# Altium schematic sheet Sensors.SchDoc
size A4; SheetNumber: 2; SheetTotal: 10
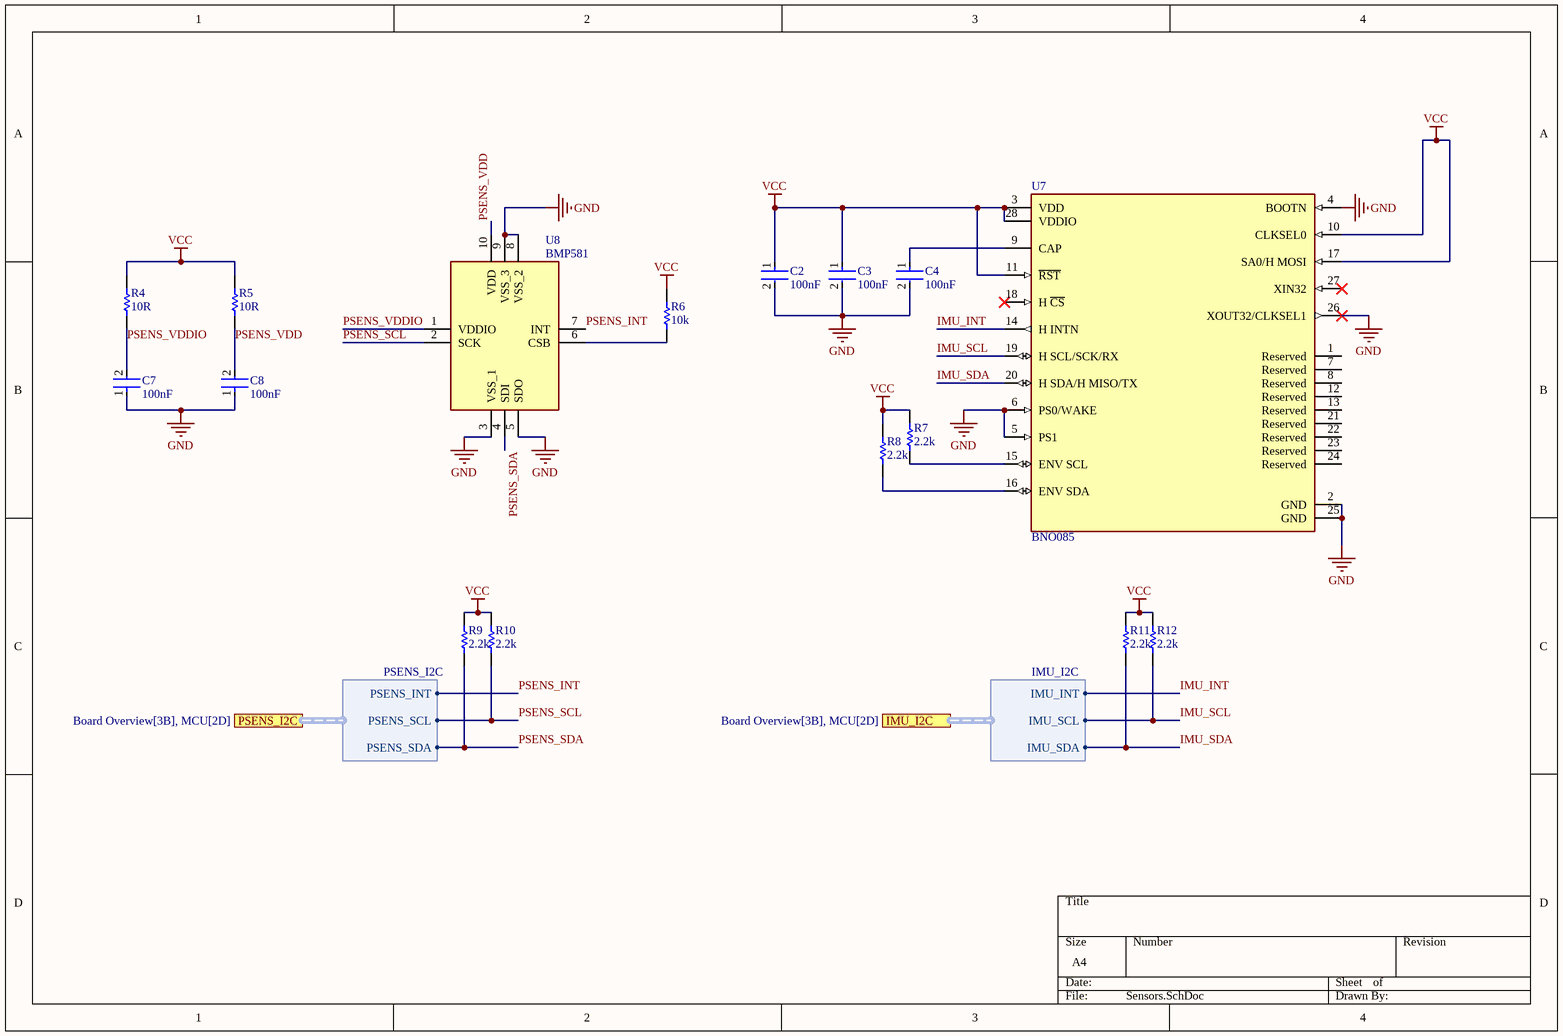
[diagram p0: Sensors.SchDoc]

## Parts
C2  value 100nF  [FP-0603-L_1_6_0_15-W_0_81-IPC_C]  (hidden comment: Generic-Capacitor)
C3  value 100nF  [FP-0603-L_1_6_0_15-W_0_81-IPC_C]  (hidden comment: Generic-Capacitor)
C4  value 100nF  [FP-0603-L_1_6_0_15-W_0_81-IPC_C]  (hidden comment: Generic-Capacitor)
C7  value 100nF  [FP-0603-L_1_6_0_15-W_0_81-IPC_C]  (hidden comment: Generic-Capacitor)
C8  value 100nF  [FP-0603-L_1_6_0_15-W_0_81-IPC_C]  (hidden comment: Generic-Capacitor)
R4  value 10R  [RESC1609X50X30ML8T20]  (hidden comment: Generic-Resistor)
R5  value 10R  [RESC1609X50X30ML8T20]  (hidden comment: Generic-Resistor)
R6  value 10k  [RESC1609X50X30ML8T20]  (hidden comment: Generic-Resistor)
R7  value 2.2k  [RESC1609X50X30ML8T20]  (hidden comment: Generic-Resistor)
R8  value 2.2k  [RESC1609X50X30ML8T20]  (hidden comment: Generic-Resistor)
R9  value 2.2k  [RESC1609X50X30ML8T20]  (hidden comment: Generic-Resistor)
R10  value 2.2k  [RESC1609X50X30ML8T20]  (hidden comment: Generic-Resistor)
R11  value 2.2k  [RESC1609X50X30ML8T20]  (hidden comment: Generic-Resistor)
R12  value 2.2k  [RESC1609X50X30ML8T20]  (hidden comment: Generic-Resistor)
U7  BNO085  [FP-BNO085-MFG]
U8  BMP581  [BMP581]

## Ports
IMU_I2C (harness IMU_I2C, see Board Overview[3B], MCU[2D]), PSENS_I2C (harness PSENS_I2C, see Board Overview[3B], MCU[2D])

## Harnesses
IMU_I2C: IMU_INT, IMU_SCL, IMU_SDA
PSENS_I2C: PSENS_INT, PSENS_SCL, PSENS_SDA

## Nets
GND: C2.2 C3.2 C4.2 C7.1 C8.1 U7.2(GND) U7.4(BOOTN) U7.5(PS1) U7.6(PS0/WAKE) U7.25(GND) U7.26(XOUT32/CLKSEL1) U8.3(VSS_1) U8.5(SDO) U8.8(VSS_2) U8.9(VSS_3)
VCC: C2.1 C3.1 R4.2 R5.2 R6.2 R7.1 R8.1 R9.1 R10.1 R11.1 R12.1 U7.3(VDD) U7.10(CLKSEL0) U7.11(~{RST}) U7.17(SA0/H_MOSI) U7.28(VDDIO)
IMU_INT: U7.14(H_INTN) ; port IMU_I2C.IMU_INT
IMU_SCL: R12.2 U7.19(H_SCL/SCK/RX) ; port IMU_I2C.IMU_SCL
IMU_SDA: R11.2 U7.20(H_SDA/H_MISO/TX) ; port IMU_I2C.IMU_SDA
PSENS_INT: U8.7(INT) ; port PSENS_I2C.PSENS_INT
PSENS_SCL: R10.2 U8.2(SCK) ; port PSENS_I2C.PSENS_SCL
PSENS_SDA: R9.2 U8.4(SDI) ; port PSENS_I2C.PSENS_SDA
PSENS_VDD: C8.2 R5.1 U8.10(VDD)
PSENS_VDDIO: C7.2 R4.1 U8.1(VDDIO)
NetC4_1: C4.1 U7.9(CAP)
NetR6_1: R6.1 U8.6(CSB)
NetR7_2: R7.2 U7.15(ENV_SCL)
NetR8_2: R8.2 U7.16(ENV_SDA)

Not connected (* = marked no-connect by the designer): U7 1(Reserved) 7(Reserved) 8(Reserved) 12(Reserved) 13(Reserved) 18(H_~{CS})* 21(Reserved) 22(Reserved) 23(Reserved) 24(Reserved) 27(XIN32)*

## Library data of the parts
C2-C4 = CMP-001-00088-6: Generic 0603 Capacitor; Dielectric: X7R; Voltage Rating: 50V; Tolerance: 10%; ESR: 0R; LCSC Part #: C14663; Case Code (Imperial): 0603
C7 C8 = CMP-001-00088-6: Generic 0603 Capacitor; Tolerance: 10%; Dielectric: X7R; ESR: 0R; Voltage Rating: 50V; Case Code (Imperial): 0603; LCSC Part #: C14663
R4-R12 = CMP-009-00185-4: Generic 0603 Resistor; Power Rating: 100mW; Tolerance: 0%; Voltage Rating: 75V; Case Code (Metric): 1608; Case Code (Imperial): 0603
  R4 R5: LCSC Part #: C22859
  R6: LCSC Part #: C25804
  R7-R12: LCSC Part #: C4190
U7 = CMP-010-00028-1: IMU Accel/gyro/mag I2C 32 Bit
U8 = CMP-048-000000-2: Pressure Sensor 4.35PSI ~ 18.13PSI (30kPa ~ 125kPa) Absolute 10-WFLGA; Manufacturer_Name: BOSCH; Geometry.Height: 0.8mm; Mouser Price/Stock: https://www.mouser.co.uk/ProductDetail/Bosch-Sensortec/BMP581?qs=Li%252BoUPsLEntPL9tlFmcgXg%3D%3D; Manufacturer_Part_Number: BMP581; Design Item ID: BMP581; Source: BMP581.SchLib; Datasheet Link: https://www.bosch-sensortec.com/media/boschsensortec/downloads/datasheets/bst-bmp581-ds004.pdf; Mouser Part Number: 262-BMP581